# Altium schematic sheet analog_breakout_IMU.SchDoc
size A; SheetNumber: 1; SheetTotal: 1
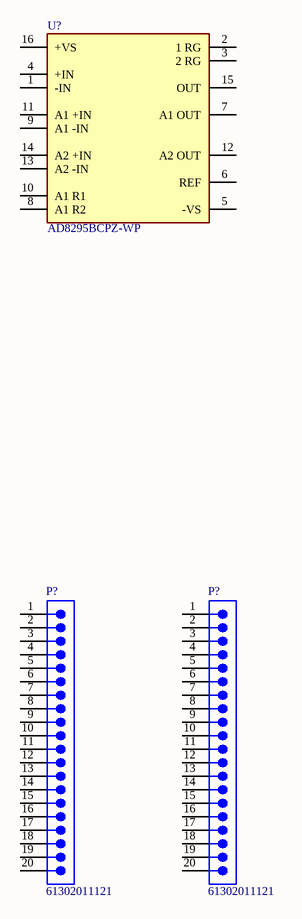
[diagram p0: analog_breakout_IMU.SchDoc]

## Parts
(Parts that share a designator on the sheet are numbered #1, #2 ... from top to bottom, then left to right.)
P?#1  61302011121  [61302011121]
P?#2  61302011121  [61302011121]
U?  AD8295BCPZ-WP  [FP-CP-16-19-IPC_C]

## Nets

Not connected (* = marked no-connect by the designer): P?#1 1 2 3 4 5 6 7 8 9 10 11 12 13 14 15 16 17 18 19 20; P?#2 1 2 3 4 5 6 7 8 9 10 11 12 13 14 15 16 17 18 19 20; U? 1(-IN) 2(1_RG) 3(2_RG) 4(+IN) 5(-VS) 6(REF) 7(A1_OUT) 8(A1_R2) 9(A1_-IN) 10(A1_R1) 11(A1_+IN) 12(A2_OUT) 13(A2_-IN) 14(A2_+IN) 15(OUT) 16(+VS)

## Library data of the parts
P?#1 P?#2 = CMP-1502-01102-3: NexarPartId: 32855554; Operating Supply Voltage: 250V; Gender: Male; Current Rating: 3A; Contact Resistance: 20mΩ; Number of Contacts: 20; Pitch: 2.54mm; Connector Type: Male Pin; RoHS: Compliant; Contact Plating: Gold; REACH SVHC: Unknown; Packaging: Bulk; Lead Pitch: 2.54mm; Mount: Through Hole; Termination: Solder; Number of Pins: 20; Contact Mating Length: 5.9944mm; Number of Rows: 1; Color: Black; Contact Material: Copper; Orientation: Vertical; Number of Positions: 20
U? = CMP-09116-000488-1: IC INST AMP 3 CIRCUIT 16LFCSP; Min Supply Voltage: 2.3V; Number of Circuits: 3; Nominal Supply Current: 2mA; Operating Supply Current: 2.3mA; Dual Supply Voltage: 9V; Max Dual Supply Voltage: 18V; Input Offset Voltage (Vos): 120uV; Common Mode Rejection Ratio: 140dB; Amplifier Type: INSTRUMENTATION AMPLIFIER; Output Current per Channel: 18mA; Input Bias Current: 800pA; Input Resistance: 100GR; Number of Amplifiers: 2; Slew Rate: 2V/µs; Gain Bandwidth Product: 1MHz; -3db Bandwidth: 1.2MHz; Voltage Gain: 60dB; Power Supply Rejection Ratio (PSRR): 150dB; Number of Elements: 1; Width: 4mm; Max Operating Temperature: 85°C; Supply Current: 2mA; Series: -; Height: 0.83mm; Case/Package: VQFN; Packaging: Waffle; Min Dual Supply Voltage: 2.3V; Mount: Surface Mount; Max Supply Voltage: 18V; Contact Plating: Tin; Min Operating Temperature: -40°C; Reach SVHC Compliant: Yes; Package Quantity: 64; Number of Channels: 3; Number of Pins: 16; Length: 4mm; Bandwidth: 1.2MHz; RoHS Compliant: Yes; Lead Free: Contains Lead